# Altium schematic sheet [2] Power Budget.SchDoc
size A3; DocumentNumber: 2; SheetNumber: 2; SheetTotal: 11
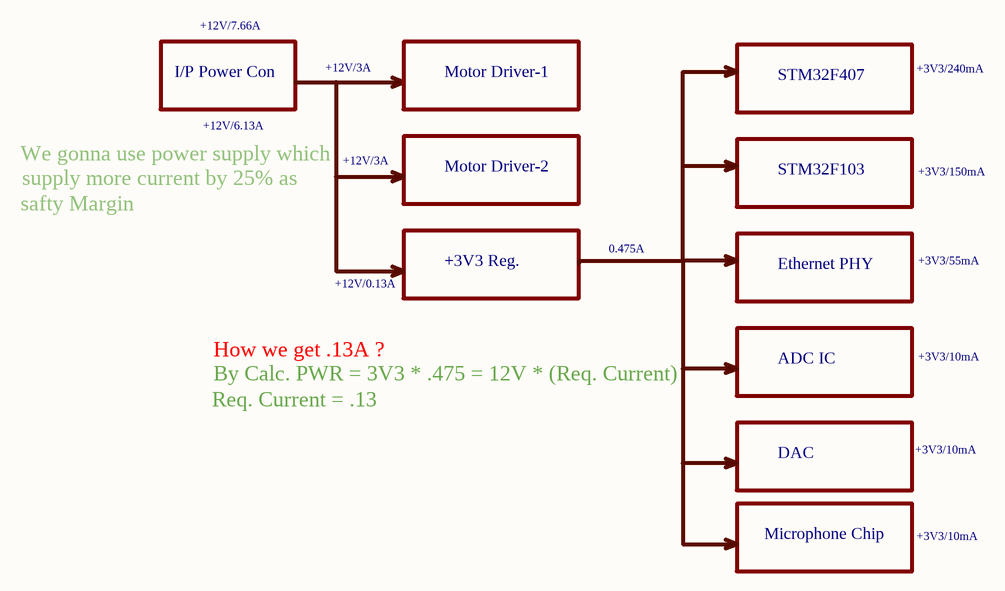
[diagram p0: [2] Power Budget.SchDoc]

## Notes on the sheet
- +12V/7.66A
- I/P Power Con
- +12V/6.13A
- +12V/3A
- Motor Driver-1
- STM32F407
- +3V3/240mA
- We gonna use power supply which
- supply more current by 25% as
- Motor Driver-2
- STM32F103
- +3V3/150mA
- safty Margin
- +3V3 Reg.
- 0.475A
- Ethernet PHY
- +3V3/55mA
- +12V/0.13A
- Req. Current = .13
- How we get .13A ?
- By Calc. PWR = 3V3 * .475 = 12V * (Req. Current)
- ADC IC
- +3V3/10mA
- DAC
- Microphone Chip